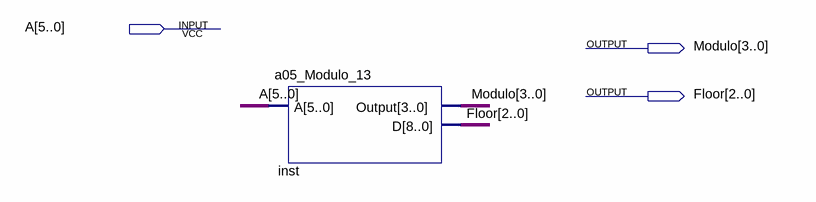
[diagram p0: schematic sheet]
// Quartus schematic a05_Modulo_13_top.bdf as structural Verilog: 1 symbols, 3 pins
module a05_Modulo_13_top (
  input  [5:0] A,
  output [3:0] Modulo,
  output [2:0] Floor
);

  a05_Modulo_13 inst (.A(A), .Output(Modulo), .D(Floor));
endmodule
